# EAGLE design YuSynth VCA Eurorack v1 (EAGLE 9.6.2)
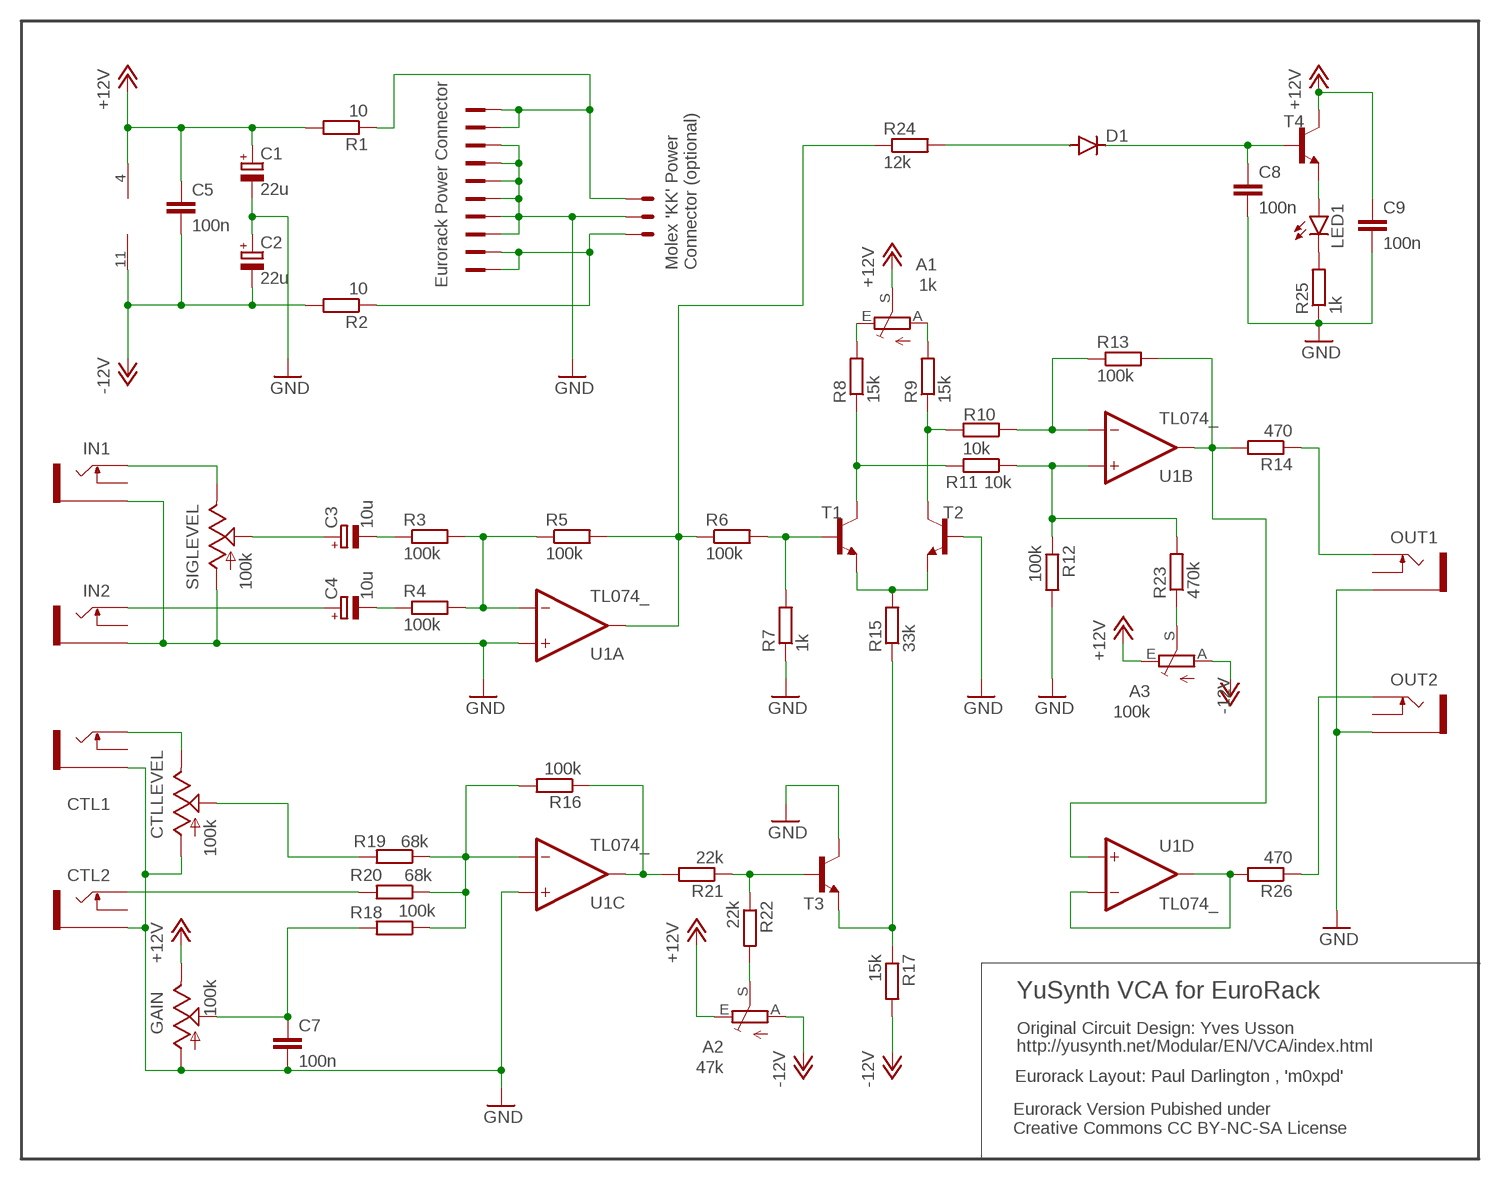
[diagram p0: schematic, sheet 1]

## Parts
A1  1k  TRIM_EU-B25P  [B25P]
A2  47k  TRIM_EU-B25P  [B25P]
A3  100k  TRIM_EU-B25P  [B25P]
C1  22u  CPOL-EUE2.5-5  [E2,5-5]
C2  22u  CPOL-EUE2.5-5  [E2,5-5]
C3  10u  CPOL-EUE2.5-5  [E2,5-5]
C4  10u  CPOL-EUE2.5-5  [E2,5-5]
C5  100n  C-EU050-025X075  [C050-025X075]
C7  100n  C-EU050-025X075  [C050-025X075]
C8  100n  C-EU050-025X075  [C050-025X075]
C9  100n  C-EU050-025X075  [C050-025X075]
CTL1  THONKICONNNEW  [WQP-PJ301M-12_JACK]
CTL2  THONKICONNNEW  [WQP-PJ301M-12_JACK]
CTLLEVEL  100k  9MM_SNAP-IN_POT_  [9MM_SNAP-IN_POT]
D1  1N4148DO35-7  [DO35-7]
EURORACK_POWER  2510-  [PAK100/2500-10]
GAIN  100k  9MM_SNAP-IN_POT_  [9MM_SNAP-IN_POT]
IN1  THONKICONNNEW  [WQP-PJ301M-12_JACK]
IN2  THONKICONNNEW  [WQP-PJ301M-12_JACK]
LED1  LED3MM  [LED3MM]
OUT1  THONKICONNNEW  [WQP-PJ301M-12_JACK]
OUT2  THONKICONNNEW  [WQP-PJ301M-12_JACK]
POWER  22-23-2031  [22-23-2031]
R1  10  R-EU_0204/7  [0204/7]
R2  10  R-EU_0204/7  [0204/7]
R3  100k  R-EU_0204/7  [0204/7]
R4  100k  R-EU_0204/7  [0204/7]
R5  100k  R-EU_0204/7  [0204/7]
R6  100k  R-EU_0204/7  [0204/7]
R7  1k  R-EU_0204/7  [0204/7]
R8  15k  R-EU_0204/7  [0204/7]
R9  15k  R-EU_0204/7  [0204/7]
R10  10k  R-EU_0204/7  [0204/7]
R11  10k  R-EU_0204/7  [0204/7]
R12  100k  R-EU_0204/7  [0204/7]
R13  100k  R-EU_0204/7  [0204/7]
R14  470  R-EU_0204/7  [0204/7]
R15  33k  R-EU_0204/7  [0204/7]
R16  100k  R-EU_0204/7  [0204/7]
R17  15k  R-EU_0204/7  [0204/7]
R18  100k  R-EU_0204/7  [0204/7]
R19  68k  R-EU_0204/7  [0204/7]
R20  68k  R-EU_0204/7  [0204/7]
R21  22k  R-EU_0204/7  [0204/7]
R22  22k  R-EU_0204/7  [0204/7]
R23  470k  R-EU_0204/7  [0204/7]
R24  12k  R-EU_0204/7  [0204/7]
R25  1k  R-EU_0204/7  [0204/7]
R26  470  R-EU_0204/7  [0204/7]
SIGLEVEL  100k  9MM_SNAP-IN_POT_  [9MM_SNAP-IN_POT]
T1  2N3904  [TO92]
T2  2N3904  [TO92]
T3  2N3904  [TO92]
T4  2N3904  [TO92]
U1  TL074_  [DIL14]

## Nets
+12V: A1.S A2.E A3.E C1.+ C5.1 C9.1 GAIN.3(E) R1.2 T4.1(C) U1.4(P:V+)
-12V: A2.A A3.A C2.- C5.2 R2.2 R17.2 U1.11(P:V-)
GND: C1.- C2.+ C7.2 C8.2 C9.2 CTL1.P$3_SLEEVE(SLEEVE) CTL2.P$3_SLEEVE(SLEEVE) CTLLEVEL.1(A) EURORACK_POWER.3 EURORACK_POWER.4 EURORACK_POWER.5 EURORACK_POWER.6 EURORACK_POWER.7 EURORACK_POWER.8 GAIN.1(A) IN1.P$3_SLEEVE(SLEEVE) IN2.P$3_SLEEVE(SLEEVE) OUT1.P$3_SLEEVE(SLEEVE) OUT2.P$3_SLEEVE(SLEEVE) POWER.2 R7.1 R12.2 R25.1 SIGLEVEL.1(A) T2.2(B) T3.1(C) U1.3(A:+IN) U1.10(C:+IN)
N$1: IN1.P$1_TIP(TIP) SIGLEVEL.3(E)
N$2: LED1.K(C) R25.2
N$3: C3.+ SIGLEVEL.2(S)
N$4: C3.- R3.1
N$5: C4.+ IN2.P$1_TIP(TIP)
N$6: C4.- R4.1
N$7: R3.2 R4.2 R5.1 U1.2(A:-IN)
N$8: R16.2 R18.1 R19.1 R20.1 U1.9(C:-IN)
N$9: R15.1 R17.1 T3.3(E)
N$10: CTL2.P$1_TIP(TIP) R20.2
N$11: CTL1.P$1_TIP(TIP) CTLLEVEL.3(E)
N$12: R6.2 R7.2 T1.2(B)
N$13: R16.1 R21.2 U1.8(C:OUT)
N$14: R21.1 R22.1 T3.2(B)
N$15: A2.S R22.2
N$16: R8.1 R11.2 T1.1(C)
N$17: R9.1 R10.2 T2.1(C)
N$18: R15.2 T1.3(E) T2.3(E)
N$19: A1.E R8.2
N$20: A1.A R9.2
N$21: A3.S R23.1
N$22: R10.1 R13.1 U1.6(B:-IN)
N$23: R11.1 R12.1 R23.2 U1.5(B:+IN)
N$26: R13.2 R14.2 U1.7(B:OUT) U1.12(D:+IN)
N$27: D1.A R24.2
N$28: C8.1 D1.C T4.2(B)
N$29: R26.2 U1.13(D:-IN) U1.14(D:OUT)
N$30: OUT1.P$1_TIP(TIP) R14.1
N$31: LED1.A T4.3(E)
N$32: R5.2 R6.1 R24.1 U1.1(A:OUT)
N$33: OUT2.P$1_TIP(TIP) R26.1
N$34: CTLLEVEL.2(S) R19.2
N$35: C7.1 GAIN.2(S) R18.2
N$36: EURORACK_POWER.9 EURORACK_POWER.10 POWER.1 R1.1
N$38: EURORACK_POWER.1 EURORACK_POWER.2 POWER.3 R2.1
Unconnected: CTL1.P$2_SWITCH(SWITCH) CTL2.P$2_SWITCH(SWITCH) IN1.P$2_SWITCH(SWITCH) IN2.P$2_SWITCH(SWITCH) OUT1.P$2_SWITCH(SWITCH) OUT2.P$2_SWITCH(SWITCH)

## Notes on the sheet
- Molex 'KK' Power 
  Connector (optional)
- Eurorack Power Connector
- YuSynth VCA for EuroRack
- Original Circuit Design: Yves Usson
- http://yusynth.net/Modular/EN/VCA/index.html
- Eurorack Layout: Paul Darlington , 'm0xpd'
- Eurorack Version Pubished under 
  Creative Commons CC BY-NC-SA License

## Library data of the parts
A1-A3 = pot:TRIM_EU-: POTENTIOMETER
C1-C4 = rcl:CPOL-EU: POLARIZED CAPACITOR, European symbol; SPICEPREFIX: C
C5 C7-C9 = rcl:C-EU: CAPACITOR, European symbol; SPICEPREFIX: C
CTL1 CTL2 IN1 IN2 OUT1 OUT2 = MusicThingModular:THONKICONN: 3.5mm socket for Eurorack modular synths
CTLLEVEL GAIN SIGLEVEL = MusicThingModular:9MM_SNAP-IN_POT: 9mm vertical snap-in pot, Alpha / Panasonic style
D1 = diode:1N4148: DIODE high speed (Philips)
EURORACK_POWER = con-3m:2510-: 3M (TM) Pak 100 4-Wall Header Source: 3M; MF: 3M; MPN: 2510-6002UB; OC_FARNELL: 9838244; OC_NEWARK: 46F4725
LED1 = led:LED: LED OSRAM: - CHIPLED LG R971, LG N971, LY N971, LG Q971, LY Q971, LO R971, LY R971 LH N974, LH R974 LS Q976, LO Q976, LY Q976 LO Q996 - Hyper CHIPLED LW Q18S LB Q993, LB Q99A, LB R99A - SideLED LS A670, LO A670, LY A670, LG A670, LP A670 LB A673, LV A673, LT A673, LW A673 LH A674 LY A675 LS A676, LA A676, LO A676, LY A676, LW A676 LS A679, LY A679, LG A679 - Hyper Micro SIDELED® LS Y876, LA Y876, LO Y876, LY Y876 LT Y87S - SmartLED LW L88C, LW L88S LB L89C, LB L89S, LG L890 LS L89K, LO L89K, LY L89K LS L896, LA L896, LO L896, LY L896 - TOPLED LS T670, LO T670, LY T670, LG T670, LP T670 LSG T670, LSP T670, LSY T670, LOP T670, LYG T670 LG T671, LOG T671, LSG T671 LB T673, LV T673, LT T673, LW T673 LH T674 LS T676, LA T676, LO T676, LY T676, LB T676, LH T676, LSB T676, LW T676 LB T67C, LV T67C, LT T67C, LS T67K, LO T67K, LY T67K, LW E67C LS E67B, LA E67B, LO E67B, LY E67B, LB E67C, LV E67C, LT E67C LW T67C LS T679, LY T679, LG T679 LS T770, LO T770, LY T770, LG T770, LP T770 LB T773, LV T773, LT T773, LW T773 LH T774 LS E675, LA E675, LY E675, LS T675 LS T776, LA T776, LO T776, LY T776, LB T776 LHGB T686 LT T68C, LB T68C - Hyper Mini TOPLED® LB M676 - Mini TOPLED Santana® LG M470 LS M47K, LO M47K, LY M47K Source: http://www.osram.convergy.de LUXEON: - LUMILED® LXK2-PW12-R00, LXK2-PW12-S00, LXK2-PW14-U00, LXK2-PW14-V00 LXK2-PM12-R00, LXK2-PM12-S00, LXK2-PM14-U00 LXK2-PE12-Q00, LXK2-PE12-R00, LXK2-PE12-S00, LXK2-PE14-T00, LXK2-PE14-U00 LXK2-PB12-K00, LXK2-PB12-L00, LXK2-PB12-M00, LXK2-PB14-N00, LXK2-PB14-P00, LXK2-PB14-Q00 LXK2-PR12-L00, LXK2-PR12-M00, LXK2-PR14-Q00, LXK2-PR14-R00 LXK2-PD12-Q00, LXK2-PD12-R00, LXK2-PD12-S00 LXK2-PH12-R00, LXK2-PH12-S00 LXK2-PL12-P00, LXK2-PL12-Q00, LXK2-PL12-R00 Source: www.luxeon.com KINGBRIGHT: KA-3528ASYC Source: www.kingbright.com
POWER = con-molex:22-23-2031: .100" (2.54mm) Center Header - 3 Pin; MF: MOLEX; MPN: 22-23-2031; OC_FARNELL: 1462950; OC_NEWARK: 30C0862
R1-R26 = rcl:R-EU_: RESISTOR, European symbol; SPICEPREFIX: R
T1-T4 = transistor:2N3904: NPN TRANSISTOR
U1 = MusicThingModular:TL074: Generic Quad Op Amp

## Board
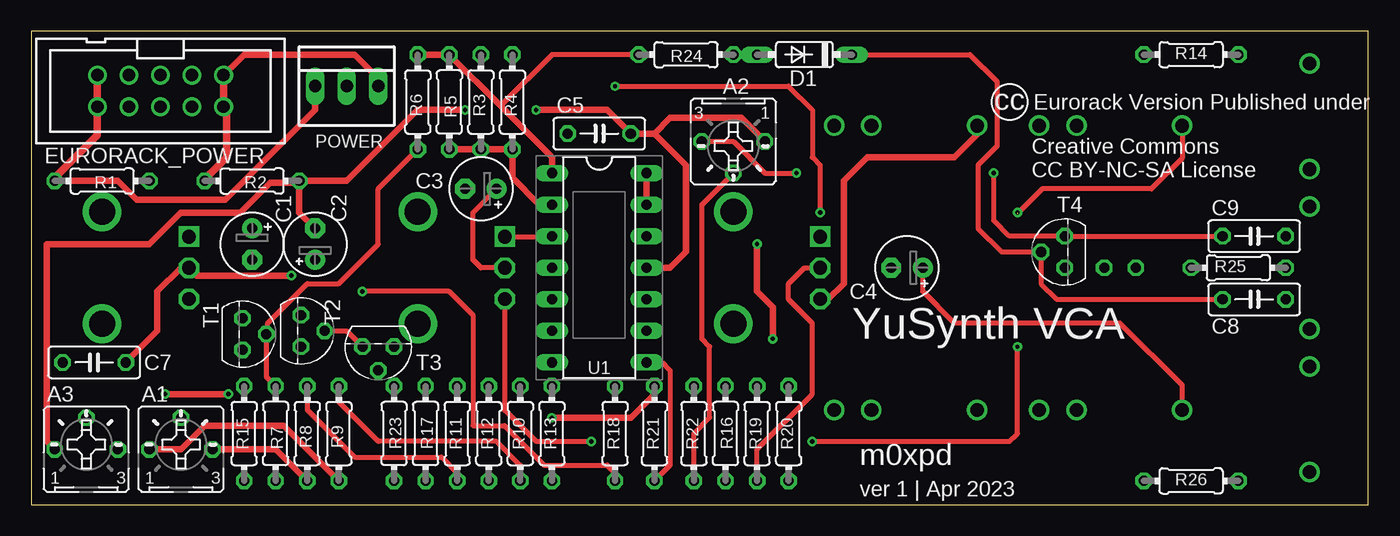
[diagram p1: board, top side]
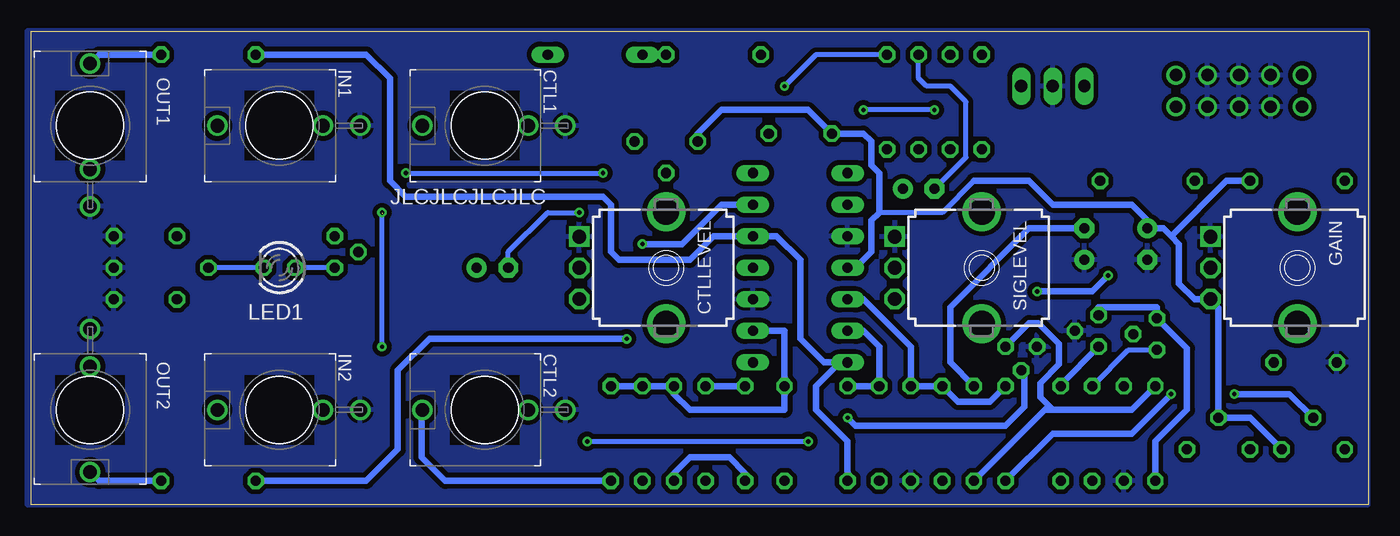
[diagram p2: board, bottom side, seen from below]

Size 107.62 x 38.09 mm. Coordinates in mm from the lower left corner, seen from the top.
Outline: 0,0 107.62,0 107.62,38.09 0,38.09 0,0
Copper layers (1*16): Top 0.035mm / dielectric 1.5mm / Bottom 0.035mm
Design rules "default *": minimum track width 6mil, minimum drill 0.35mm, track to track 15mil, track to pad 15mil, pad to pad 6mil, via to via 6mil, smd to smd 6mil, copper to edge 0mil, drill to drill 6mil, minimum pad ring 10mil, minimum via ring 8mil, stop-mask expansion 4mil, vias tented up to drill 0mil, thermal gap 10mil

### Footprints (pad centres in the part's own frame; a part is rotated, then mirrored left to right if it is on the bottom)
B25P = drill 0.813 octagon: A -2.54,0; E 2.54,0; S 0,2.54
E2,5-5 = drill 0.813 pad 1.6: + -1.27,0 | drill 0.813 pad 1.6 octagon: - 1.27,0
C050-025X075 = drill 0.813 octagon: 1 -2.54,0; 2 2.54,0
WQP-PJ301M-12_JACK = drill 1.1: P$1_TIP 0,5; P$2_SWITCH 0,-3.5; P$3_SLEEVE 0,-6.5
9MM_SNAP-IN_POT = drill 1.1 square: 1 -2.5,-7 | drill 1.1 octagon: 2 0,-7; 3 2.5,-7 | drill 2.1 pad 2.794: CHASSIS1 -4.5,0; CHASSIS2 4.5,0
DO35-7 = drill 0.813 long: A 3.81,0; C -3.81,0
PAK100/2500-10 = drill 1 pad 1.422: 1 -5.08,-1.27; 2 -5.08,1.27; 3 -2.54,-1.27; 4 -2.54,1.27; 5 0,-1.27; 6 0,1.27; 7 2.54,-1.27; 8 2.54,1.27; 9 5.08,-1.27; 10 5.08,1.27
LED3MM = drill 0.813 octagon: A -1.27,0; K 1.27,0
22-23-2031 = drill 1 long: 1 -2.54,0; 2 0,0; 3 2.54,0
0204/7 = drill 0.813 octagon: 1 -3.81,0; 2 3.81,0
TO92 = drill 0.813 octagon: 1 1.27,0; 2 0,1.905; 3 -1.27,0
DIL14 = drill 0.813 long: 1 -7.62,-3.81; 2 -5.08,-3.81; 3 -2.54,-3.81; 4 0,-3.81; 5 2.54,-3.81; 6 5.08,-3.81; 7 7.62,-3.81; 8 7.62,3.81; 9 5.08,3.81; 10 2.54,3.81; 11 0,3.81; 12 -2.54,3.81; 13 -5.08,3.81; 14 -7.62,3.81

### Placement (x,y rotation side)
A1  12.06,4.45 0 top
A2  56.52,29.21 180 top
A3  4.45,4.45 0 top
C1  17.78,20.95 270 top
C2  22.86,20.95 90 top
C3  36.2,25.4 180 top
C4  70.48,19.05 180 top
C5  45.72,29.84 0 top
C7  5.08,11.43 180 top
C8  98.42,16.51 0 top
C9  98.42,21.59 0 top
CTL1  71.12,30.48 90 bottom
CTL2  71.12,7.62 90 bottom
CTLLEVEL  56.52,19.05 270 bottom
D1  62.23,36.2 180 top
EURORACK_POWER  10.41,33.27 180 top
GAIN  5.71,19.05 270 bottom
IN1  87.63,30.48 90 bottom
IN2  87.63,7.62 90 bottom
LED1  87.63,19.05 180 bottom
OUT1  102.87,30.48 0 bottom
OUT2  102.87,7.62 180 bottom
POWER  25.4,33.66 0 top
R1  5.71,26.04 0 top
R2  17.78,26.04 0 top
R3  36.2,32.38 270 top
R4  38.73,32.38 270 top
R5  33.66,32.38 90 top
R6  31.11,32.38 270 top
R7  19.68,5.71 90 top
R8  22.23,5.71 270 top
R9  24.77,5.71 270 top
R10  39.37,5.71 270 top
R11  34.29,5.71 270 top
R12  36.83,5.71 270 top
R13  41.91,5.71 270 top
R14  93.34,36.2 180 top
R15  17.14,5.71 270 top
R16  55.88,5.71 90 top
R17  31.75,5.71 90 top
R18  46.99,5.71 270 top
R19  58.42,5.71 270 top
R20  60.96,5.71 270 top
R21  50.16,5.71 270 top
R22  53.34,5.71 270 top
R23  29.21,5.71 90 top
R24  52.7,36.2 0 top
R25  97.16,19.05 180 top
R26  93.34,1.91 180 top
SIGLEVEL  31.11,19.05 270 bottom
T1  17.02,13.72 270 top
T2  21.72,13.97 270 top
T3  27.94,12.7 180 top
T4  83.19,20.32 90 top
U1  45.72,19.05 270 top

### Tracks (layer width: path | path; a pad name or v marks a point on that pad's centre or on a via)
+12V  (via drill 0.35)
  Top 0.406: A2.E 56.52,29.21 59.05,26.67 v61.59,26.67 | v77.47,26.67 77.47,22.86 78.74,21.59 T4.1 C9.1
  Bottom 0.406: v77.47,26.67 v61.59,26.67 | 31.75,26.04 34.29,23.5 39.37,23.5
  Bottom 0.508: R1.2 11.43,26.04 15.88,21.59 | 31.75,26.04 27.3,26.04 25.4,24.13 19.05,24.13 17.78,22.86 C1.+ 16.51,22.23 15.88,21.59 | U1.4 41.27,19.05 40.01,20.32 40.01,22.86 39.37,23.5 39.37,26.67 40.01,27.3 40.01,29.21 40.64,29.84 C5.1 45.09,31.75 52.07,31.75 53.98,29.84 A2.E | 15.88,21.59 15.24,20.95 15.24,17.78 13.97,16.51 12.76,16.51 | 12.76,16.51 GAIN.3 | 12.76,16.51 12.06,15.82 A1.S 9.53,6.99 A3.E
-12V  (via drill 0.35)
  Top 0.508: C2.- 21.59,23.5 R2.2 | R2.2 25.4,26.04 31.11,31.75 v34.92,31.75 | 50.16,29.84 52.7,27.3 52.7,20.32 51.44,19.05 U1.11 | 50.16,29.84 C5.2 46.35,31.75 v40.64,31.75 | A3.A 1.27,5.08 1.27,20.95 9.53,20.95 12.04,23.47 16.78,23.47 16.81,23.5 19.22,25.91 21.46,25.91 R2.2 | A2.A 57.15,31.11 51.44,31.11 50.16,29.84
  Bottom 0.406: v34.92,31.75 v40.64,31.75
  Bottom 0.508: C2.- 27.3,22.23 33.66,15.88 33.66,11.43 R17.2
GND
  Top 0.406: SIGLEVEL.1 41.87,21.55 U1.3 | T2.2 25.4,13.97 T3.1
  pour Bottom: 0,38.1 107.95,38.1 107.95,0 0,0
N$1  (via drill 0.35)  (1 unrouted)
  Top 0.406: SIGLEVEL.3 38.12,7.63 | 38.1,7.62 40.64,5.08 v45.09,5.08 | v62.87,5.08 78.74,5.08 79.38,5.71 v79.38,12.7 | IN1.P$1_TIP 92.63,27.86 90.17,25.4 81.38,25.4 79.38,23.4
  Top 0.508: 38.12,7.63 38.1,7.62
  Bottom 0.406: v62.87,5.08 v45.09,5.08 | v79.38,12.7 v79.38,23.5
N$2
  Bottom 0.406: LED1.K R25.2
N$3
  Top 0.406: SIGLEVEL.2 36.2,19.05 35.56,19.68 35.56,23.5 C3.+
N$4
  Bottom 0.406: R3.1 36.2,34.29 35.56,33.66 33.66,33.66 32.38,32.38 32.38,27.94 C3.-
N$5
  Top 0.406: IN2.P$1_TIP 92.63,9.61 87.63,14.61 74.3,14.61 71.75,17.14 C4.+
N$6  (via drill 0.35)
  Top 0.406: v46.99,33.66 60.96,33.66 62.87,31.75 62.87,27.94 63.5,27.3 v63.5,23.5
  Bottom 0.406: C4.- 69.22,20.32 66.04,23.5 v63.5,23.5 | R4.1 44.45,36.2 v46.99,33.66
N$7
  Top 0.508: U1.2 40.89,24.13 38.73,26.29 R4.2 R3.2 R5.1
N$8
  Bottom 0.508: R19.1 R20.1 R16.2 55.88,8.89 54.61,7.62 46.99,7.62 R18.1 46.99,13.97 U1.9
N$9
  Bottom 0.508: 25.72,7.94 25.4,7.62 | 25.82,7.62 25.4,7.62 | 25.4,7.62 19.05,7.62 R15.1 | R17.1 25.72,7.94 | 25.72,7.94 26.42,8.64 26.42,9.78 24.89,11.3 24.89,12.95 26.54,14.61 27.3,14.61 T3.3
N$10
  Bottom 0.508: R20.2 74.3,1.91 76.2,3.81 76.2,7.54 CTL2.P$1_TIP
N$11
  Top 0.508: CTLLEVEL.3 64.17,16.55 65.41,17.78 65.41,26.04 67.31,27.94 74.3,27.94 76.2,29.84 76.2,30.4 CTL1.P$1_TIP
N$12
  Top 0.406: T1.2 18.92,10.29 R7.2 | 19.05,13.84 19.05,14.61 22.23,17.78 24.77,17.78 27.94,20.95 27.94,25.4 R6.2
  Top 0.508: T1.2 19.05,13.84
N$13
  Top 0.406: R21.2 51.44,3.17 51.44,10.79 50.8,11.43 U1.8
  Bottom 0.508: R21.2 50.16,2.54 51.44,3.81 54.61,3.81 55.88,2.54 R16.1
N$14  (via drill 0.35)
  Top 0.508: v41.91,6.99 48.26,6.99 50.16,8.89 R21.1
  Bottom 0.508: R22.1 R21.1 | T3.2 27.69,10.54 27.69,7.87 29.21,6.35 41.27,6.35 v41.91,6.99
N$15
  Top 0.406: R22.2 53.34,5.71 54.61,6.99 54.61,12.7 53.98,13.34 53.98,24.13 A2.S
N$16
  Top 0.406: R8.1 22.23,7.62 26.04,3.81 33.02,3.81 34.29,2.54 R11.2
  Bottom 0.406: R8.1 19.3,12.45 T1.1
N$17
  Top 0.406: R10.2 39.37,3.17 37.47,5.08 27.94,5.08 24.77,8.26 R9.1
  Bottom 0.508: T2.1 24.77,9.65 R9.1
N$18
  Bottom 0.508: T2.3 21.72,15.88 17.02,15.88 T1.3 14.61,12.57 14.61,7.62 17.14,5.08 R15.2
N$19
  Top 0.508: R8.2 19.68,4.45 A1.E
N$20
  Top 0.508: R9.2 20.32,6.35 13.97,6.35 12.06,4.45 A1.A
N$21  (via drill 0.35)
  Top 0.508: v10.79,8.89 v15.88,8.89
  Bottom 0.508: A3.S 6.35,8.89 v10.79,8.89 | R23.1 25.4,5.71 19.05,5.71 v15.88,8.89
N$22
  Bottom 0.508: R13.1 R10.1 39.37,12.7 40.64,13.97 U1.6
N$23
  Bottom 0.508: U1.5 40.64,16.51 36.83,12.7 R12.1 R11.1 33.02,8.26 30.48,8.26 R23.2
N$26
  Bottom 0.508: R13.2 41.91,5.08 44.45,7.62 44.45,9.53 42.55,11.43 U1.7 43.81,11.43 45.72,13.34 45.72,19.68 47.62,21.59 U1.12 52.7,21.59 54.61,19.68 60.33,19.68 60.96,20.32 60.96,24.13 61.59,24.77 77.47,24.77 78.74,26.04 78.74,34.29 80.64,36.2 R14.2
N$27
  Top 0.508: D1.A R24.2
N$28
  Top 0.406: C8.1 82.55,16.51 81.28,17.78 T4.2 78.11,20.32 76.2,22.23 76.2,27.3 77.72,28.83 77.72,34.04 75.56,36.2 D1.C
N$29  (via drill 0.35)
  Top 0.508: U1.13 U1.14 | v58.42,20.95 58.42,17.14 59.69,15.88 v59.69,13.34
  Bottom 0.508: U1.13 52.07,24.13 55.24,20.95 v58.42,20.95 | v59.69,13.34 75.56,13.34 78.11,10.79 78.11,4.45 80.64,1.91 R26.2
N$30
  Bottom 0.508: R14.1 102.16,36.2 OUT1.P$1_TIP
N$31
  Bottom 0.406: T4.3 LED1.A
N$32
  Top 0.406: 37.78,32.07 41.91,36.2 R24.1
  Top 0.508: R6.1 R5.2 37.78,32.07 41.91,27.94 U1.1
N$33
  Bottom 0.508: R26.1 102.16,1.91 OUT2.P$1_TIP
N$34
  Top 0.406: CTLLEVEL.2 62.23,19.05 60.96,17.78 60.96,16.51 62.87,14.61 62.87,8.89 58.42,4.45 R19.2
N$35  (via drill 0.35)
  Top 0.406: v26.67,17.14 33.66,17.14 35.56,15.24 35.56,6.35 38.1,6.35 41.27,3.17 46.35,3.17 46.99,2.54 R18.2
  Top 0.508: C7.1 10.16,13.97 10.16,17.14 12.06,19.05 GAIN.2 | GAIN.2 | v20.95,18.41 13.34,18.41 GAIN.2
  Bottom 0.508: v26.67,17.14 22.23,17.14 v20.95,18.41
N$36
  Top 0.508: POWER.1 22.86,31.75 15.62,24.51 8.51,24.51 6.99,26.04 R1.1 1.91,26.29
  Top 0.61: 1.91,26.29 5.33,29.72 EURORACK_POWER.10 EURORACK_POWER.9
N$38
  Top 0.508: POWER.3 27.94,34.29 26.04,36.2 17.14,36.2 EURORACK_POWER.1 | R2.1 13.97,26.16 | 15.75,31.75 EURORACK_POWER.2
  Top 0.61: 13.97,26.16 15.75,27.94 15.75,31.75 | EURORACK_POWER.2 EURORACK_POWER.1

### Text on the board
tNames: cc | Eurorack Version Published under | Creative Commons / CC BY-NC-SA License | YuSynth VCA | m0xpd | ver 1 | Apr 2023
bNames: JLCJLCJLCJLC